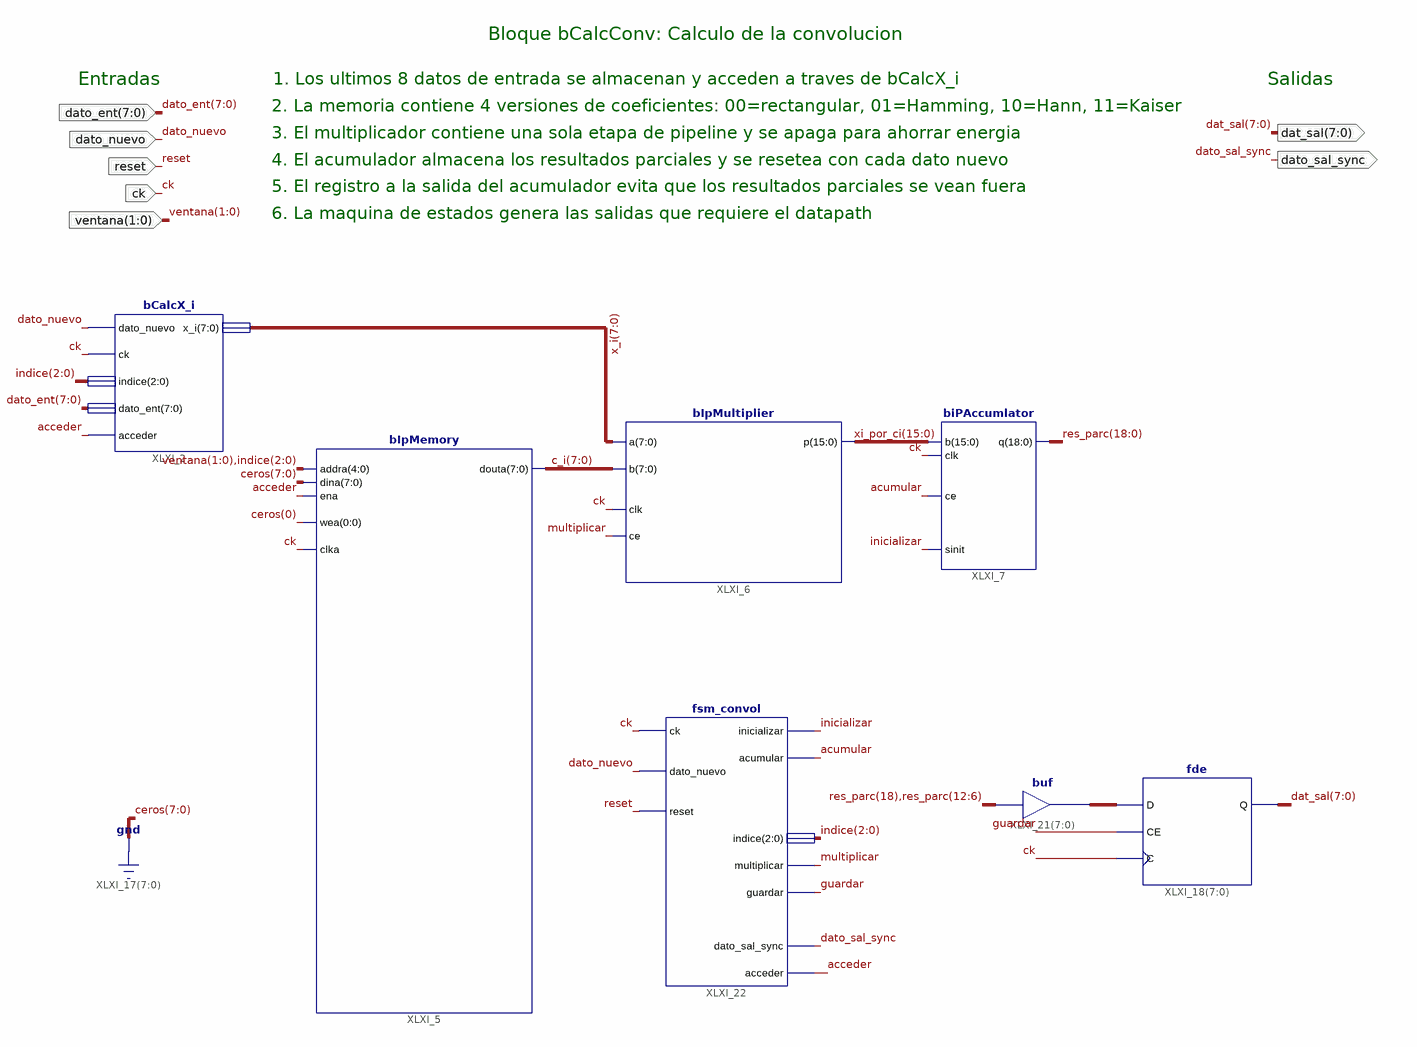
[diagram p0: schematic sheet 1]
// Xilinx ISE schematic bCalcConv.sch (spartan6) as structural Verilog: 7 symbols, 7 ports
module bCalcConv (
  input  dato_nuevo,
  input  ck,
  input  reset,
  input  [7:0] dato_ent,
  input  [1:0] ventana,
  output [7:0] dat_sal,
  output dato_sal_sync
);

  wire acceder, acumular, guardar, inicializar, multiplicar;
  wire [2:0] indice;
  wire [7:0] c_i, res_parcl, x_i;
  wire [15:0] xi_por_ci;
  wire [18:0] res_parc;

  assign res_parcl = {res_parc[18], res_parc[12:6]};  // buf XLXI_21[7..0], 8 bits wide
  bCalcX_i XLXI_2 (
    .dato_nuevo(dato_nuevo), .ck(ck), .dato_ent(dato_ent), .indice(indice), .x_i(x_i), .acceder(acceder));
  bIpMemory XLXI_5 (.addra({ventana, indice}), .dina({8{1'b0}}), .ena(acceder), .wea(1'b0), .clka(ck), .douta(c_i));
  fsm_convol XLXI_22 (
    .ck(ck), .dato_nuevo(dato_nuevo), .reset(reset), .inicializar(inicializar), .multiplicar(multiplicar),
    .acumular(acumular), .guardar(guardar), .dato_sal_sync(dato_sal_sync), .indice(indice), .acceder(acceder));
  biPAccumlator XLXI_7 (.b(xi_por_ci), .clk(ck), .ce(acumular), .sinit(inicializar), .q(res_parc));
  bIpMultiplier XLXI_6 (.a(x_i), .b(c_i), .clk(ck), .ce(multiplicar), .p(xi_por_ci));
  fde XLXI_18[7:0] (.C(ck), .CE(guardar), .D(res_parcl), .Q(dat_sal));

  // Notes on the sheet:
  //   Bloque bCalcConv: Calculo de la convolucion
  //   Entradas
  //   1. Los ultimos 8 datos de entrada se almacenan y acceden a traves de bCalcX_i
  //   Salidas
  //   2. La memoria contiene 4 versiones de coeficientes: 00=rectangular, 01=Hamming, 10=Hann, 11=Kaiser
  //   3. El multiplicador contiene una sola etapa de pipeline y se apaga para ahorrar energia
  //   4. El acumulador almacena los resultados parciales y se resetea con cada dato nuevo
  //   5. El registro a la salida del acumulador evita que los resultados parciales se vean fuera
  //   6. La maquina de estados genera las salidas que requiere el datapath
endmodule
